# Altium schematic sheet CAN.SchDoc
size A4; SheetNumber: 4; SheetTotal: 4
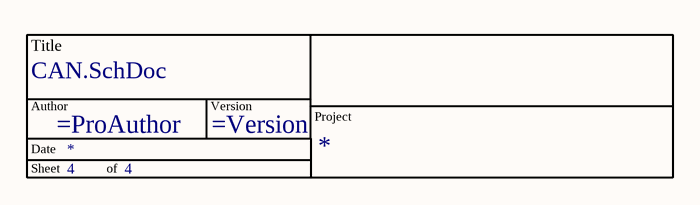
[diagram p0: CAN.SchDoc]

## Parts
?  Title_Block  (value not drawn)

## Notes on the sheet
- (in symbol Title_Block) Title; Author; Version; Project; Date; Sheet; of